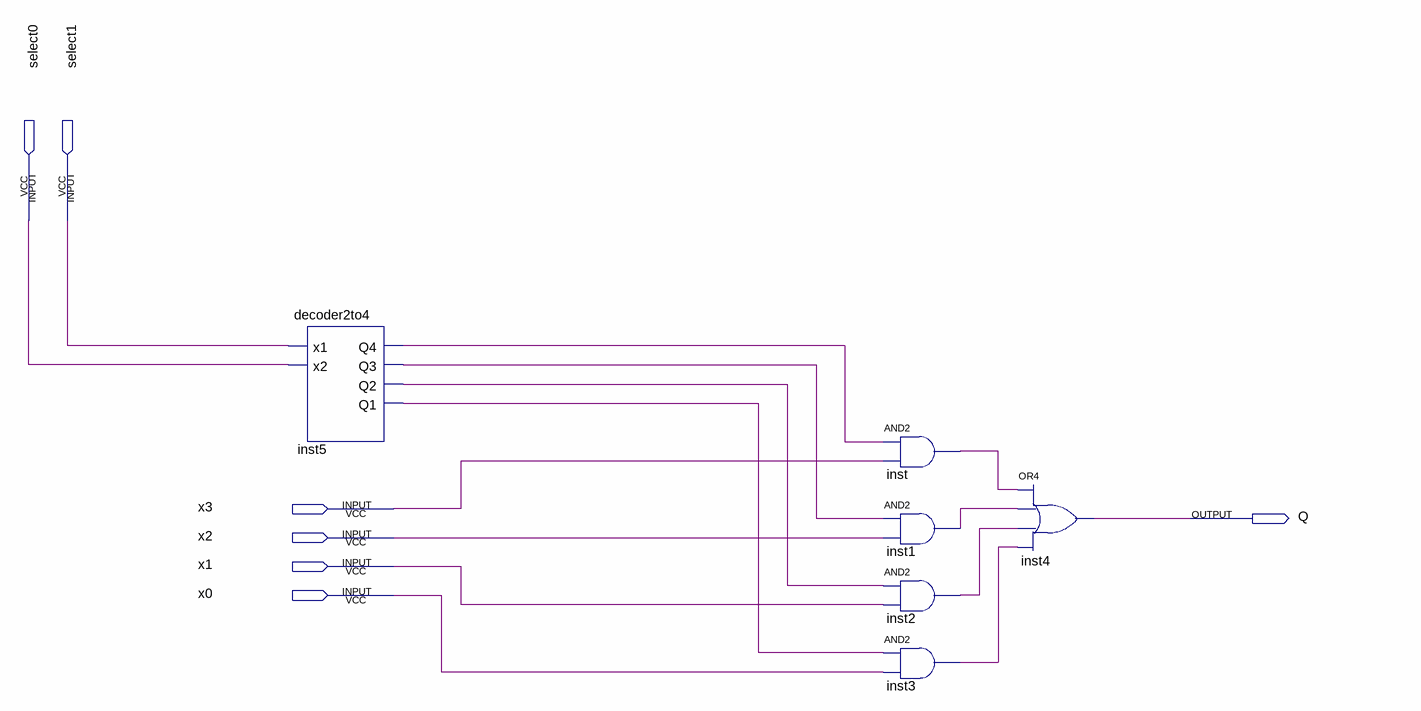
[diagram p0: schematic sheet]
// Quartus schematic mux4to1.bdf as structural Verilog: 6 symbols, 7 pins
module mux4to1 (
  input  select0,
  input  select1,
  input  x3,
  input  x2,
  input  x1,
  input  x0,
  output Q
);

  wire inst1_out, inst2_out, inst3_out, inst5_q1, inst5_q2, inst5_q3, inst5_q4, inst_out;

  decoder2to4 inst5 (.x1(select1), .x2(select0), .Q4(inst5_q4), .Q3(inst5_q3), .Q2(inst5_q2), .Q1(inst5_q1));
  and inst (inst_out, inst5_q4, x3);
  and inst1 (inst1_out, inst5_q3, x2);
  and inst2 (inst2_out, inst5_q2, x1);
  and inst3 (inst3_out, inst5_q1, x0);
  or inst4 (Q, inst_out, inst1_out, inst2_out, inst3_out);
endmodule
